# Altium schematic sheet alarm_clock_devkit_inputs.SchDoc
size 290 x 209 mm
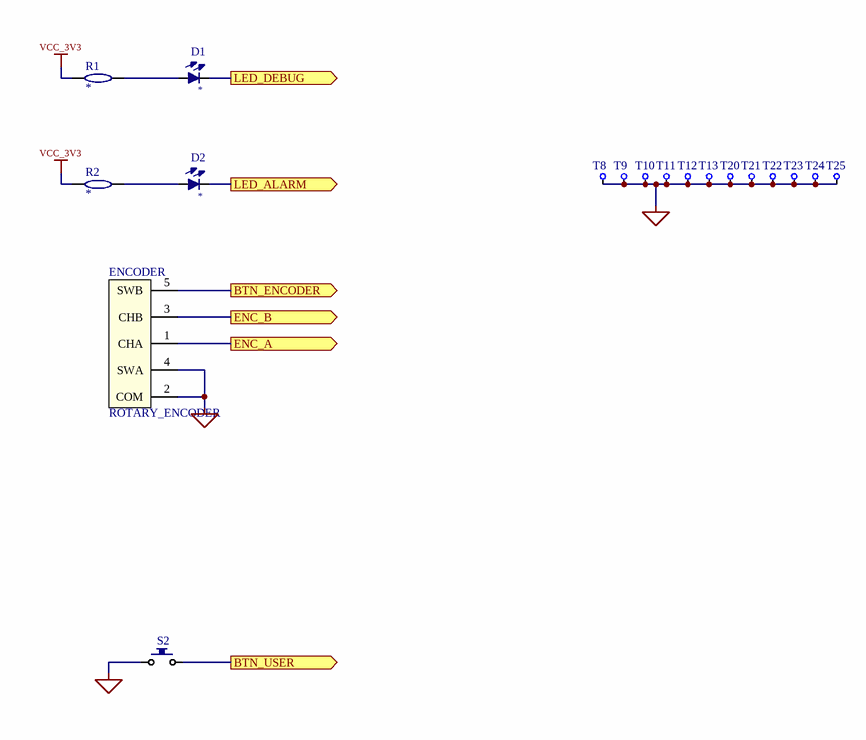
[diagram p0: alarm_clock_devkit_inputs.SchDoc]

## Parts
D1  *  [SMT_LED 0603_RED]
D2  *  [SMT_LED 0603_RED]
ENCODER  ROTARY_ENCODER  [ENCODER]
R1  *  [RES 0603_1608]
R2  *  [RES 0603_1608]
S2  4-1437565-1  [FSM-SWITCH]  (value not drawn)
T8  TESTPOINT  [TESTPOINT_TH]  (value not drawn)
T9  TESTPOINT  [TESTPOINT_TH]  (value not drawn)
T10  TESTPOINT  [TESTPOINT_TH]  (value not drawn)
T11  TESTPOINT  [TESTPOINT_TH]  (value not drawn)
T12  TESTPOINT  [TESTPOINT_TH]  (value not drawn)
T13  TESTPOINT  [TESTPOINT_TH]  (value not drawn)
T20  TESTPOINT  [TESTPOINT_TH]  (value not drawn)
T21  TESTPOINT  [TESTPOINT_TH]  (value not drawn)
T22  TESTPOINT  [TESTPOINT_TH]  (value not drawn)
T23  TESTPOINT  [TESTPOINT_TH]  (value not drawn)
T24  TESTPOINT  [TESTPOINT_TH]  (value not drawn)
T25  TESTPOINT  [TESTPOINT_TH]  (value not drawn)

## Ports
BTN_ENCODER (out), BTN_USER (out), ENC_A (out), ENC_B (out), LED_ALARM (out), LED_DEBUG (out)

## Nets
GND: ENCODER.2(COM) ENCODER.4(SWA) S2.1 T8.1 T9.1 T10.1 T11.1 T12.1 T13.1 T20.1 T21.1 T22.1 T23.1 T24.1 T25.1
VCC_3V3: R1.1(A) R2.1(A)
BTN_ENCODER: ENCODER.5(SWB) ; port BTN_ENCODER
BTN_USER: S2.2 ; port BTN_USER
ENC_A: ENCODER.1(CHA) ; port ENC_A
ENC_B: ENCODER.3(CHB) ; port ENC_B
LED_ALARM: D2.2(CATHODE) ; port LED_ALARM
LED_DEBUG: D1.2(CATHODE) ; port LED_DEBUG
NetD1_1: D1.1(ANODE) R1.2(B)
NetD2_1: D2.1(ANODE) R2.2(B)

## Library data of the parts
D1 D2 = LED: Value: *; LCSC Part Number: *
ENCODER = ROTARY_ENCODER: Rotary Encoder
R1 R2 = RESISTOR: Value: *; LCSC Part Number: *; Tolerance: *; Package: *; Power: *
S2 = BUTTON: 6x6mm tactile switch SPST_NO; Manufacturer_Name: TE Connectivity; Allied_Number: R1117787; RS Part Number: 1616046; Manufacturer_Part_Number: 4-1437565-1; Datasheet Link: http://uk.rs-online.com/web/p/products/1616046